# EAGLE design BBBCape (EAGLE 7.2.0)
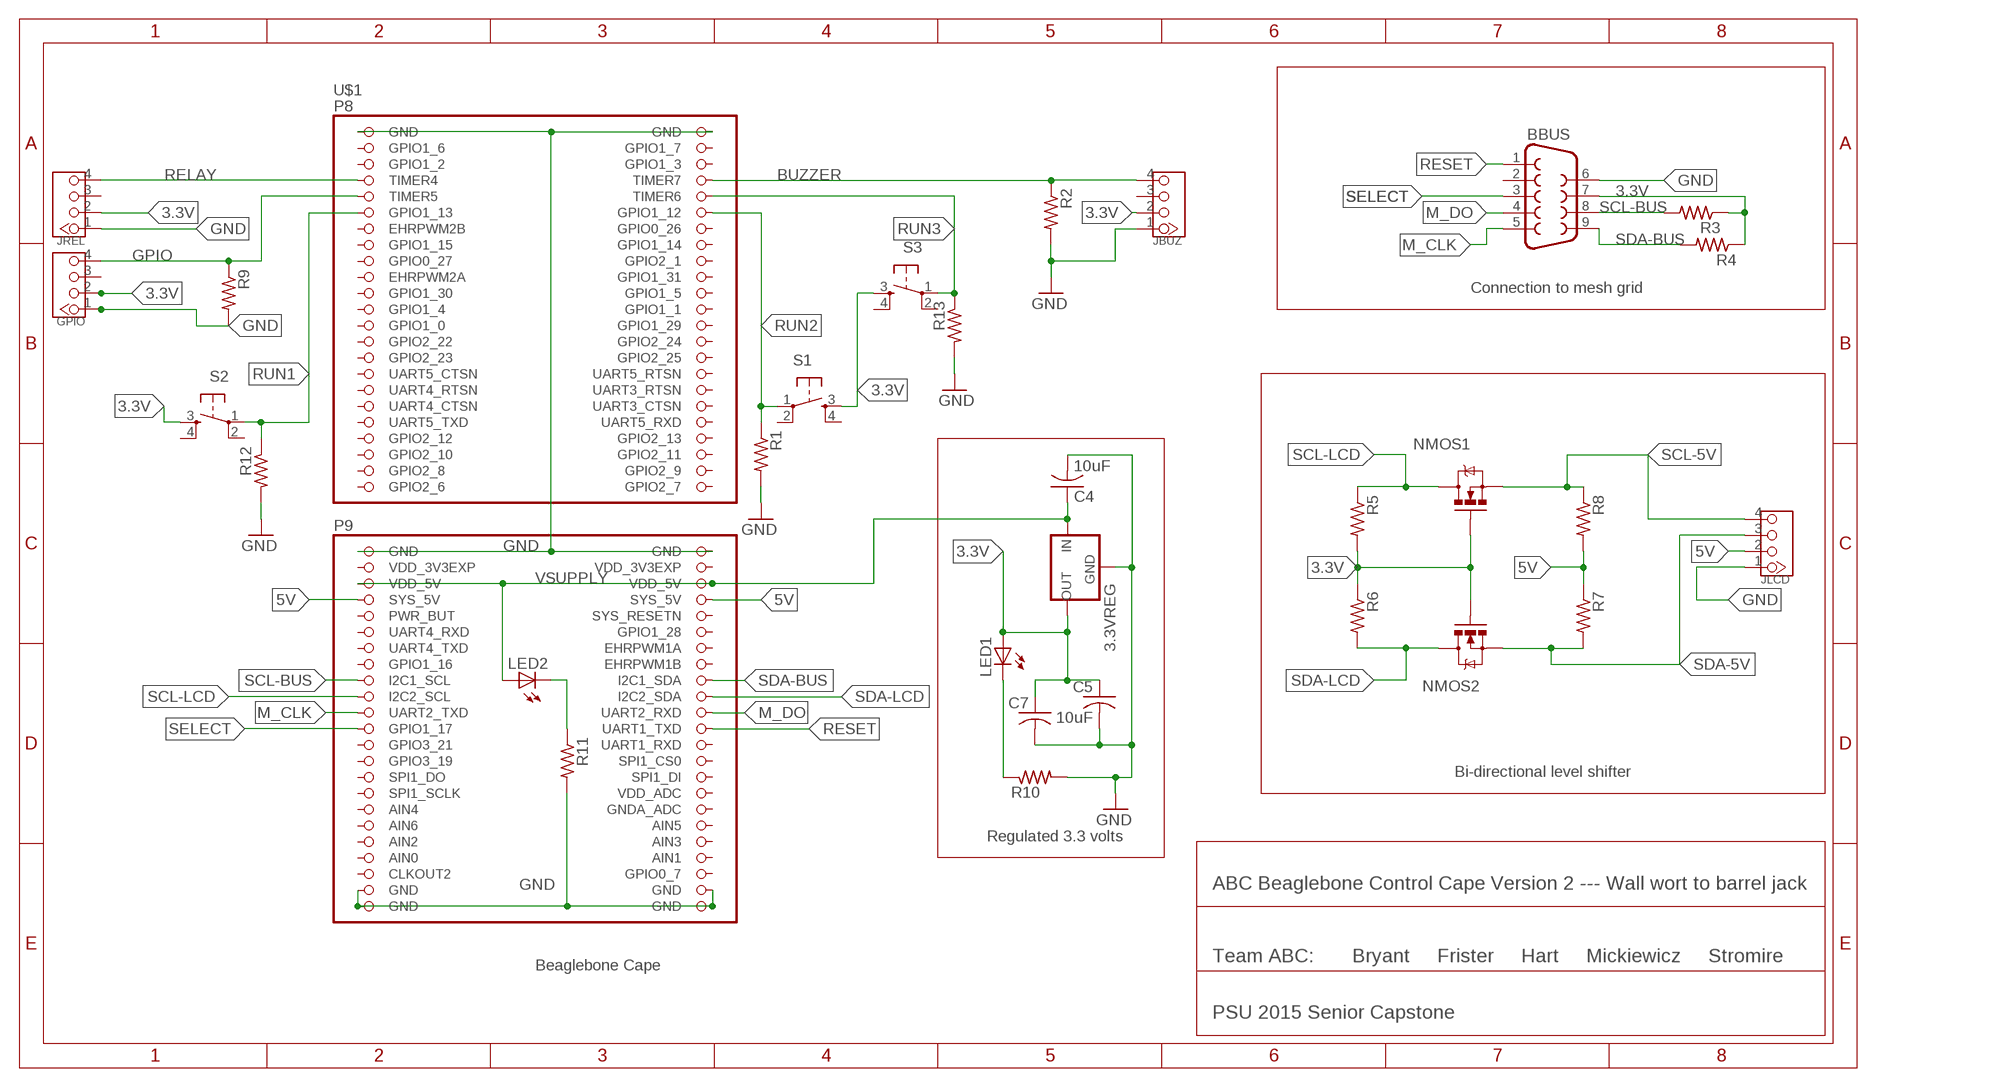
[diagram p0: schematic, sheet 1]

## Parts
3.3VREG  78XXS  [78XXS]
BBUS  F09H  [F09H]
C4  10uF  C-US025-024X044  [C025-024X044]
C5  10uF  C-US025-024X044  [C025-024X044]
C7  C-US025-024X044  [C025-024X044]
GPIO  TWIG-4P-2.0-2.0  [4P-2.0]
JBUZ  TWIG-4P-2.0-2.0  [4P-2.0]
JLCD  TWIG-4P-2.0-2.0  [4P-2.0]
JREL  TWIG-4P-2.0-2.0  [4P-2.0]
LED1  LED3MM  [LED3MM]
LED2  LED3MM  [LED3MM]
NMOS1  MOSFET-NCHANNEL2N7000  [TO-92]
NMOS2  MOSFET-NCHANNEL2N7000  [TO-92]
R1  R-US_0204/2V  [0204V]
R2  R-US_0204/2V  [0204V]
R3  R-US_0204/2V  [0204V]
R4  R-US_0204/2V  [0204V]
R5  R-US_0204/2V  [0204V]
R6  R-US_0204/2V  [0204V]
R7  R-US_0204/2V  [0204V]
R8  R-US_0204/2V  [0204V]
R9  R-US_0204/2V  [0204V]
R10  R-US_0204/2V  [0204V]
R11  R-US_0204/2V  [0204V]
R12  R-US_0204/2V  [0204V]
R13  R-US_0204/2V  [0204V]
S1  TAC_SWITCHPTH  [TACTILE-PTH]
S2  TAC_SWITCHPTH  [TACTILE-PTH]
S3  TAC_SWITCHPTH  [TACTILE-PTH]
U$1  BEAGLEBONE_OUTLINE  [BEAGLEBONE_SHIELD]

## Nets
3.3V: 3.3VREG.OUT BBUS.7 C5.1 C7.1 GPIO.2 JBUZ.2 JREL.2 LED1.A NMOS1.2(G) NMOS2.2(G) R3.1 R4.1 R5.2 R6.1 S1.3 S2.3 S3.3
5V: JLCD.2 R7.1 R8.2 U$1.53(SYS_5V) U$1.54(SYS_5V)
BUZZER: JBUZ.4 R2.1 U$1.8(TIMER7)
GND: 3.3VREG.GND BBUS.6 C4.2 C5.2 C7.2 GPIO.1 JBUZ.1 JLCD.1 JREL.1 R1.2 R2.2 R9.2 R10.2 R11.2 R12.2 R13.2 U$1.1(GND) U$1.2(GND) U$1.47(GND) U$1.48(GND) U$1.89(GND) U$1.90(GND) U$1.91(GND) U$1.92(GND)
GPIO: GPIO.4 R9.1 U$1.9(TIMER5)
M_CLK: BBUS.5 U$1.67(UART2_TXD)
M_DO: BBUS.4 U$1.68(UART2_RXD)
N$3: LED2.K(C) R11.1
N$4: LED1.K(C) R10.1
RELAY: JREL.4 U$1.7(TIMER4)
RESET: BBUS.1 U$1.70(UART1_TXD)
RUN1: R12.1 S2.1 U$1.11(GPIO1_13)
RUN2: R1.1 S1.1 U$1.12(GPIO1_12)
RUN3: R13.1 S3.1 U$1.10(TIMER6)
SCL-5V: JLCD.4 NMOS1.1(S) R8.1
SCL-BUS: BBUS.8 R3.2 U$1.63(I2C1_SCL)
SCL-LCD: NMOS1.3(D) R5.1 U$1.65(I2C2_SCL)
SDA-5V: JLCD.3 NMOS2.1(S) R7.2
SDA-BUS: BBUS.9 R4.2 U$1.64(I2C1_SDA)
SDA-LCD: NMOS2.3(D) R6.2 U$1.66(I2C2_SDA)
SELECT: BBUS.3 U$1.69(GPIO1_17)
VSUPPLY: 3.3VREG.IN C4.1 LED2.A U$1.51(VDD_5V) U$1.52(VDD_5V)
Unconnected: BBUS.2 GPIO.3 JBUZ.3 JREL.3 S1.2 S1.4 S2.2 S2.4 S3.2 S3.4 U$1.3(GPIO1_6) U$1.4(GPIO1_7) U$1.5(GPIO1_2) U$1.6(GPIO1_3) U$1.13(EHRPWM2B) U$1.14(GPIO0_26) U$1.15(GPIO1_15) U$1.16(GPIO1_14) U$1.17(GPIO0_27) U$1.18(GPIO2_1) U$1.19(EHRPWM2A) U$1.20(GPIO1_31) U$1.21(GPIO1_30) U$1.22(GPIO1_5) U$1.23(GPIO1_4) U$1.24(GPIO1_1) U$1.25(GPIO1_0) U$1.26(GPIO1_29) U$1.27(GPIO2_22) U$1.28(GPIO2_24) U$1.29(GPIO2_23) U$1.30(GPIO2_25) U$1.31(UART5_CTSN) U$1.32(UART5_RTSN) U$1.33(UART4_RTSN) U$1.34(UART3_RTSN) U$1.35(UART4_CTSN) U$1.36(UART3_CTSN) U$1.37(UART5_TXD) U$1.38(UART5_RXD) U$1.39(GPIO2_12) U$1.40(GPIO2_13) U$1.41(GPIO2_10) U$1.42(GPIO2_11) U$1.43(GPIO2_8) U$1.44(GPIO2_9) U$1.45(GPIO2_6) U$1.46(GPIO2_7) U$1.55(PWR_BUT) U$1.56(SYS_RESETN) U$1.57(UART4_RXD) U$1.58(GPIO1_28) U$1.59(UART4_TXD) U$1.60(EHRPWM1A) U$1.61(GPIO1_16) U$1.62(EHRPWM1B) U$1.71(GPIO3_21) U$1.72(UART1_RXD) U$1.73(GPIO3_19) U$1.74(SPI1_CS0) U$1.75(SPI1_DO) U$1.76(SPI1_DI) U$1.77(SPI1_SCLK) U$1.78(VDD_ADC) U$1.79(AIN4) U$1.80(GNDA_ADC) U$1.81(AIN6) U$1.82(AIN5) U$1.83(AIN2) U$1.84(AIN3) U$1.86(AIN1) U$1.87(CLKOUT2) U$1.88(GPIO0_7)

## Notes on the sheet
- Connection to mesh grid
- Bi-directional level shifter
- Regulated 3.3 volts
- ABC Beaglebone Control Cape | Version 2 --- Wall wort to barrel jack
- Team ABC:       Bryant     Frister     Hart     Mickiewicz     Stromire
- Beaglebone Cape
- PSU 2015 Senior Capstone

## Power pins joined to a net without a drawn wire
AIN0: U$1.85(AIN0)
VDD_3V3EXP: U$1.49(VDD_3V3EXP) U$1.50(VDD_3V3EXP)

## Library data of the parts
3.3VREG = v-reg:78XXS: VOLTAGE REGULATOR
BBUS = con-subd:F09: SUB-D; OC_FARNELL: unknown; OC_NEWARK: unknown
C4 C5 C7 = adafruit:C-US: CAPACITOR, American symbol
GPIO JBUZ JLCD JREL = Connector:TWIG-4P-2.0
LED1 LED2 = adafruit:LED: LED OSRAM: - CHIPLED LG R971, LG N971, LY N971, LG Q971, LY Q971, LO R971, LY R971 LH N974, LH R974 LS Q976, LO Q976, LY Q976 LO Q996 - Hyper CHIPLED LW Q18S LB Q993, LB Q99A, LB R99A - SideLED LS A670, LO A670, LY A670, LG A670, LP A670 LB A673, LV A673, LT A673, LW A673 LH A674 LY A675 LS A676, LA A676, LO A676, LY A676, LW A676 LS A679, LY A679, LG A679 - Hyper Micro SIDELED® LS Y876, LA Y876, LO Y876, LY Y876 LT Y87S - SmartLED LW L88C, LW L88S LB L89C, LB L89S, LG L890 LS L89K, LO L89K, LY L89K LS L896, LA L896, LO L896, LY L896 - TOPLED LS T670, LO T670, LY T670, LG T670, LP T670 LSG T670, LSP T670, LSY T670, LOP T670, LYG T670 LG T671, LOG T671, LSG T671 LB T673, LV T673, LT T673, LW T673 LH T674 LS T676, LA T676, LO T676, LY T676, LB T676, LH T676, LSB T676, LW T676 LB T67C, LV T67C, LT T67C, LS T67K, LO T67K, LY T67K, LW E67C LS E67B, LA E67B, LO E67B, LY E67B, LB E67C, LV E67C, LT E67C LW T67C LS T679, LY T679, LG T679 LS T770, LO T770, LY T770, LG T770, LP T770 LB T773, LV T773, LT T773, LW T773 LH T774 LS E675, LA E675, LY E675, LS T675 LS T776, LA T776, LO T776, LY T776, LB T776 LHGB T686 LT T68C, LB T68C - Hyper Mini TOPLED® LB M676 - Mini TOPLED Santana® LG M470 LS M47K, LO M47K, LY M47K Source: http://www.osram.convergy.de/
NMOS1 NMOS2 = SparkFun-DiscreteSemi:MOSFET-NCHANNEL: Common NMOSFET Parts MFG P/N Store ID Prod ID FDD8780 TRANS-09984 SI7820DN TRANS-11055 FDS6630A IC-08089 2N7002PW TRANS-11151 FQP30N06L COM-10213 TRANS-10060 BSS123LT1G TRANS-08345 BSS138 TRANS-00830 BS170 2N7000
R1-R13 = adafruit:R-US_: RESISTOR, American symbol
S1-S3 = SparkFun-Electromechanical:TAC_SWITCH: Momentary Switch Button commonly used for reset or general input. Spark Fun Electronics SKU : COM-00097 SMT- SWCH-08247
U$1 = adafruit:BEAGLEBONE_OUTLINE: Should match A3 pinout - but not completely tested

## Board
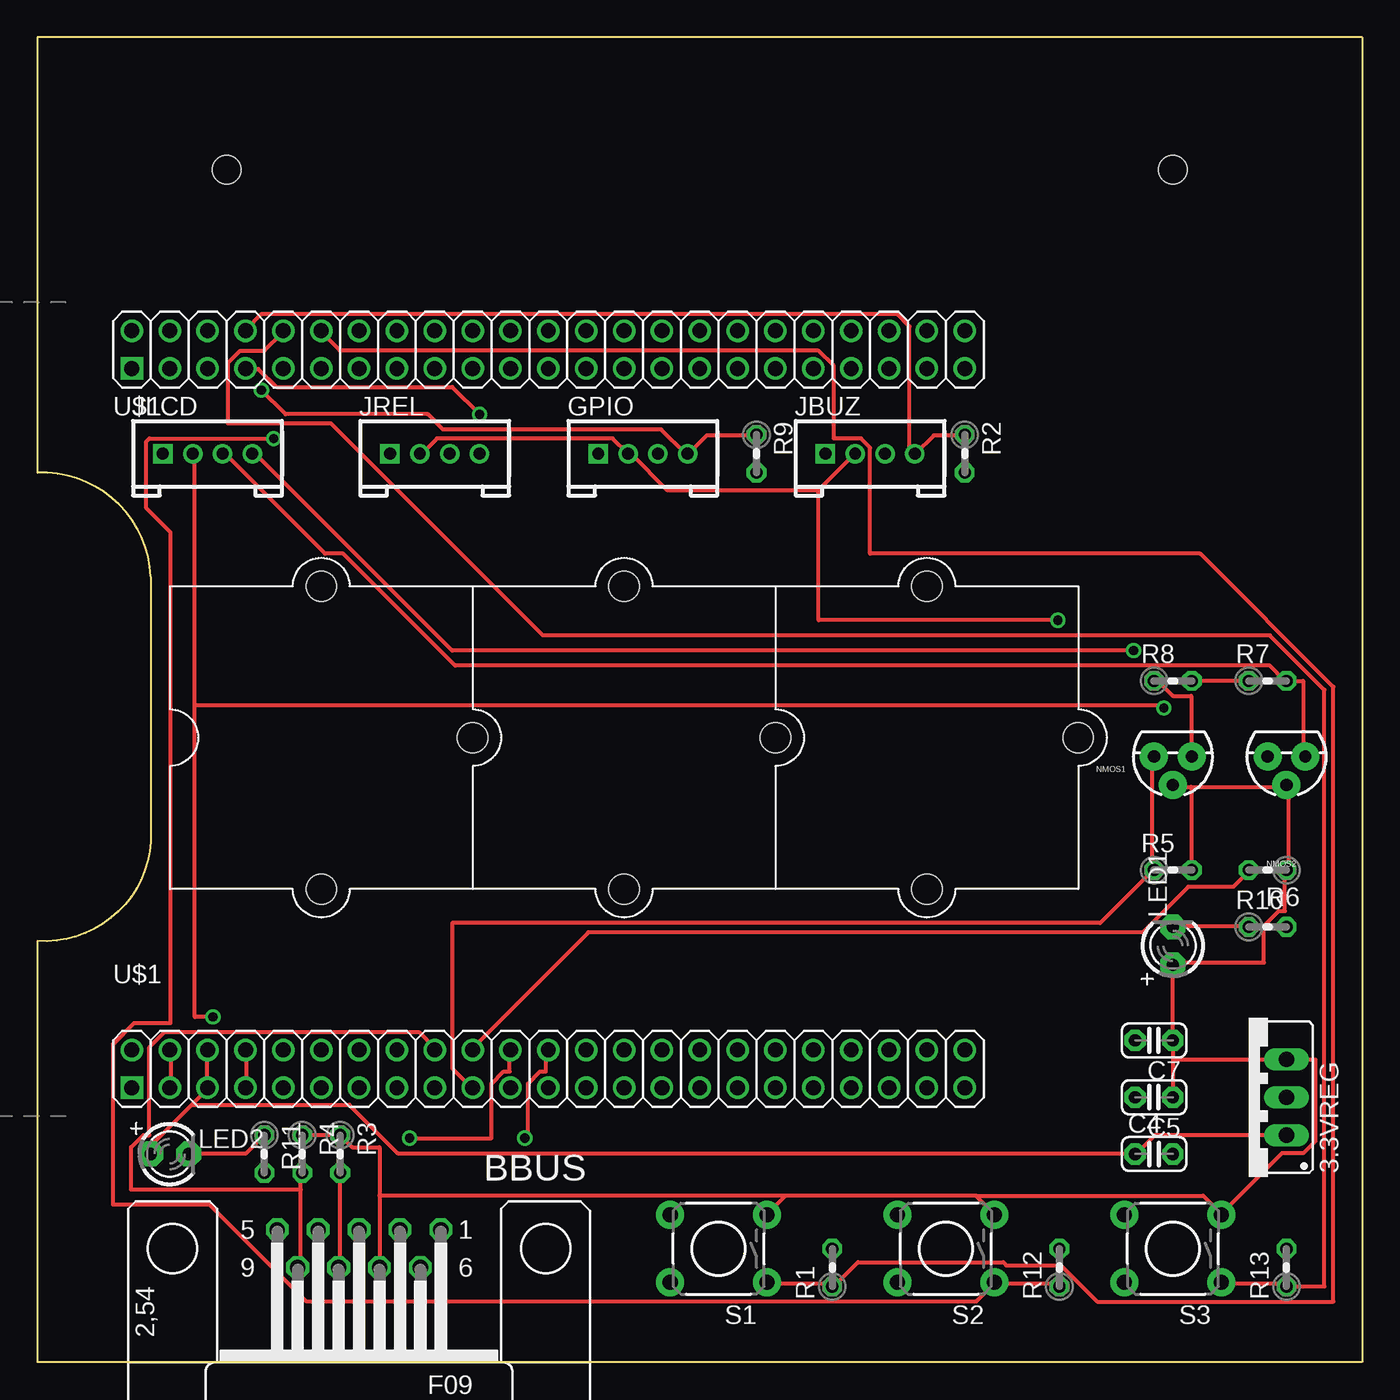
[diagram p1: board, top side]
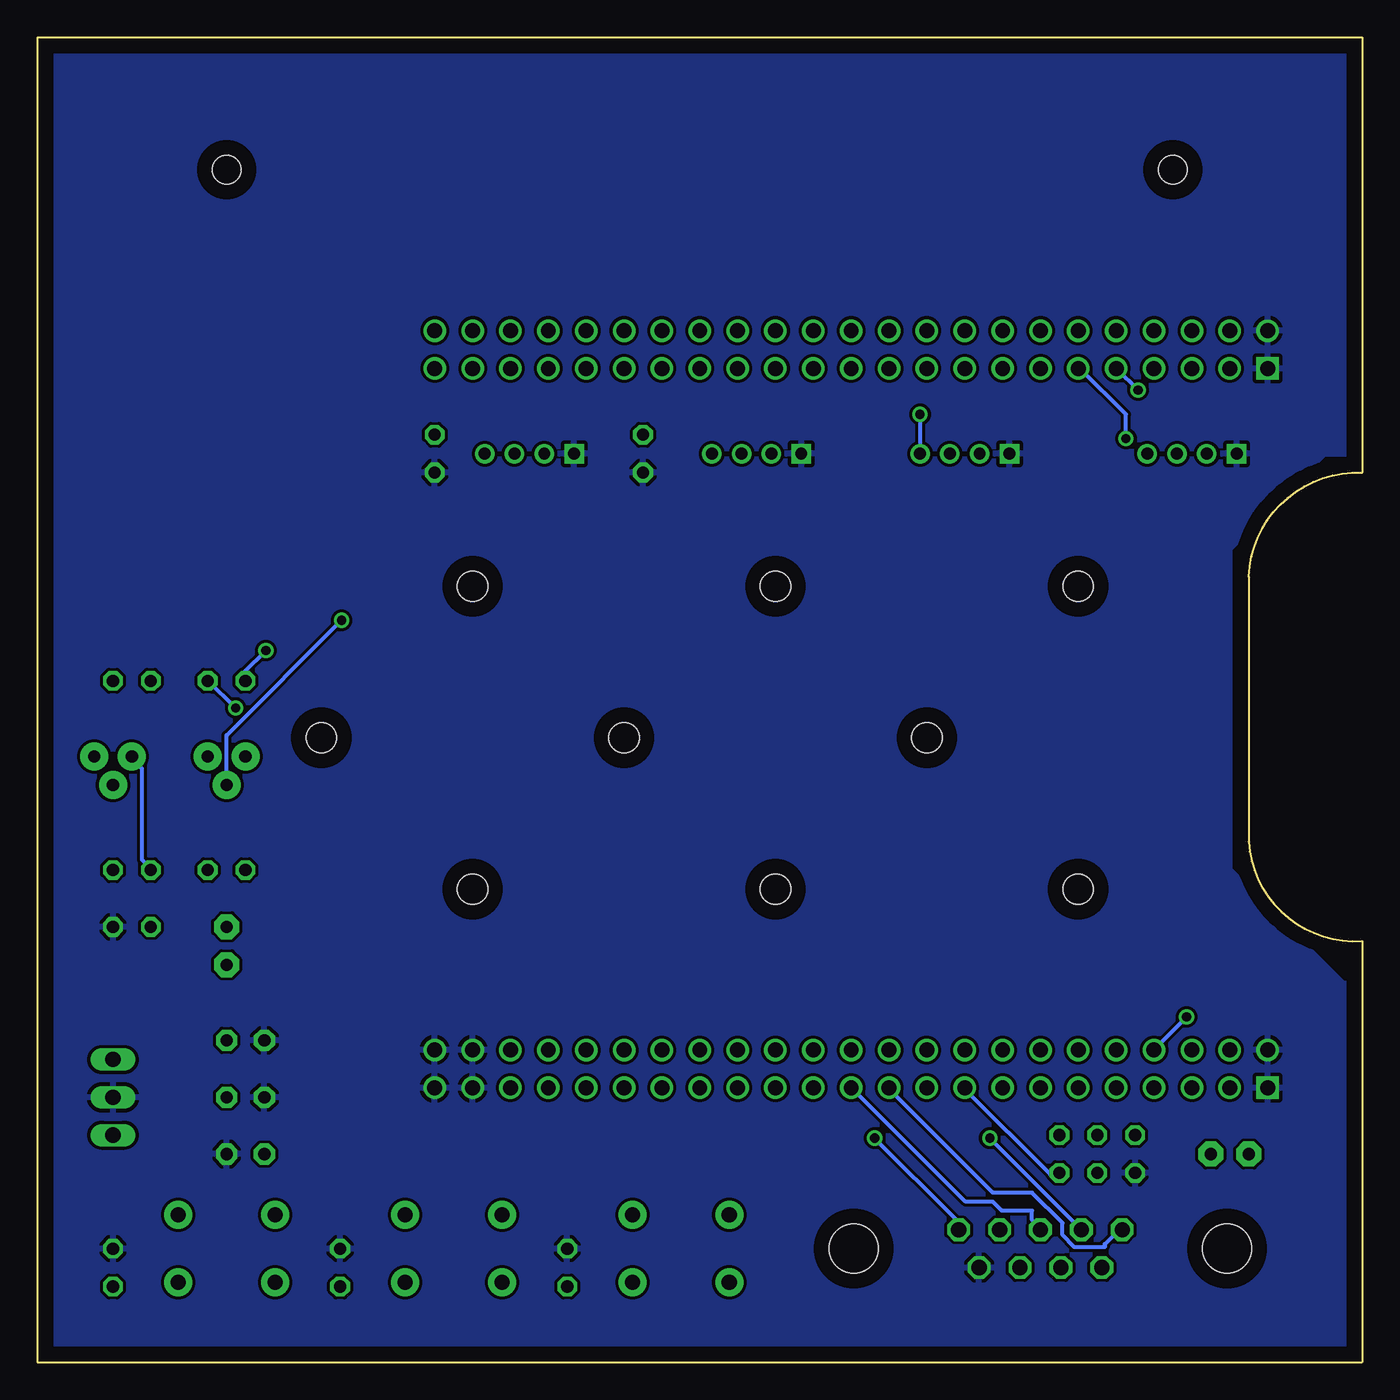
[diagram p2: board, bottom side, seen from below]

Size 88.9 x 88.9 mm. Coordinates in mm from the lower left corner, seen from the top.
Copper layers (1*16): Top 0.035mm / dielectric 1.5mm / Bottom 0.035mm
Design rules "default": minimum track width 10mil, minimum drill 24mil, track to track 8mil, track to pad 8mil, pad to pad 8mil, via to via 8mil, smd to smd 8mil, copper to edge 40mil, drill to drill 8mil, minimum pad ring 10mil, minimum via ring 8mil, stop-mask expansion 4mil, vias tented up to drill 0mil, thermal gap 10mil
Holes 1.92 mm at 12.7,80.01 76.2,80.01

### Footprints (pad centres in the part's own frame; a part is rotated, then mirrored left to right if it is on the bottom)
78XXS = drill 1.016 long: GND 0,-2.54; IN -2.54,-2.54; OUT 2.54,-2.54
F09H = drill 1.016 octagon: 1 -5.486,-1.27; 2 -2.743,-1.27; 3 0,-1.27; 4 2.743,-1.27; 5 5.486,-1.27; 6 -4.115,1.27; 7 -1.372,1.27; 8 1.372,1.27; 9 4.115,1.27 | hole 3.302: -12.522,0; 12.522,0
C025-024X044 = drill 0.813 pad 1.422 octagon: 1 -1.27,0; 2 1.27,0
SEEED = hole 2.019: 10.16,0; 10.16,20.32; 20.32,10.16
4P-2.0 = drill 0.8 pad 1.27 square: 1 -3,0 | drill 0.8 pad 1.27: 2 -1,0; 3 1,0; 4 3,0
LED3MM = drill 0.813 pad 1.676 octagon: A -1.27,0; K 1.27,0
TO-92 = drill 0.813 pad 1.88: 1 -1.27,0; 2 0,1.905; 3 1.27,0
0204V = drill 0.813 octagon: 1 -1.27,0; 2 1.27,0
TACTILE-PTH = drill 1.016 pad 1.88: 1 -3.251,2.261; 2 3.251,2.261; 3 -3.251,-2.261; 4 3.251,-2.261
BEAGLEBONE_SHIELD = drill 1 square: 1 6.35,66.675; 47 6.35,18.415 | drill 1: 2 6.35,69.215; 3 8.89,66.675; 4 8.89,69.215; 5 11.43,66.675; 6 11.43,69.215; 7 13.97,66.675; 8 13.97,69.215; 9 16.51,66.675; 10 16.51,69.215; 11 19.05,66.675; 12 19.05,69.215; 13 21.59,66.675; 14 21.59,69.215; 15 24.13,66.675; 16 24.13,69.215; 17 26.67,66.675; 18 26.67,69.215; 19 29.21,66.675; 20 29.21,69.215; 21 31.75,66.675; 22 31.75,69.215; 23 34.29,66.675; 24 34.29,69.215; 25 36.83,66.675; 26 36.83,69.215; 27 39.37,66.675; 28 39.37,69.215; 29 41.91,66.675; 30 41.91,69.215; 31 44.45,66.675; 32 44.45,69.215; 33 46.99,66.675; 34 46.99,69.215; 35 49.53,66.675; 36 49.53,69.215; 37 52.07,66.675; 38 52.07,69.215; 39 54.61,66.675; 40 54.61,69.215; 41 57.15,66.675; 42 57.15,69.215; 43 59.69,66.675; 44 59.69,69.215; 45 62.23,66.675; 46 62.23,69.215; 48 6.35,20.955; 49 8.89,18.415; 50 8.89,20.955; 51 11.43,18.415; 52 11.43,20.955; 53 13.97,18.415; 54 13.97,20.955; 55 16.51,18.415; 56 16.51,20.955; 57 19.05,18.415; 58 19.05,20.955; 59 21.59,18.415; 60 21.59,20.955; 61 24.13,18.415; 62 24.13,20.955; 63 26.67,18.415; 64 26.67,20.955; 65 29.21,18.415; 66 29.21,20.955; 67 31.75,18.415; 68 31.75,20.955; 69 34.29,18.415; 70 34.29,20.955; 71 36.83,18.415; 72 36.83,20.955; 73 39.37,18.415; 74 39.37,20.955; 75 41.91,18.415; 76 41.91,20.955; 77 44.45,18.415; 78 44.45,20.955; 79 46.99,18.415; 80 46.99,20.955; 81 49.53,18.415; 82 49.53,20.955; 83 52.07,18.415; 84 52.07,20.955; 85 54.61,18.415; 86 54.61,20.955; 87 57.15,18.415; 88 57.15,20.955; 89 59.69,18.415; 90 59.69,20.955; 91 62.23,18.415; 92 62.23,20.955

### Placement (x,y rotation side)
3.3VREG  81.28,17.78 90 top
BBUS  21.59,7.62 180 top
C4  74.93,13.97 0 top
C5  74.93,17.78 180 top
C7  74.93,21.59 180 top
E$1  [SEEED]  8.89,31.75 0 top
E$2  [SEEED]  29.21,31.75 0 top
E$3  [SEEED]  49.53,31.75 0 top
GPIO  40.64,60.96 0 top
JBUZ  55.88,60.96 0 top
JLCD  11.43,60.96 0 top
JREL  26.67,60.96 0 top
LED1  76.2,27.94 90 top
LED2  8.89,13.97 0 top
NMOS1  76.2,40.64 180 top
NMOS2  83.82,40.64 180 top
R1  53.34,6.35 90 top
R2  62.23,60.96 270 top
R3  20.32,13.97 270 top
R4  17.78,13.97 270 top
R5  76.2,33.02 0 top
R6  82.55,33.02 180 top
R7  82.55,45.72 0 top
R8  76.2,45.72 0 top
R9  48.26,60.96 270 top
R10  82.55,29.21 0 top
R11  15.24,13.97 270 top
R12  68.58,6.35 90 top
R13  83.82,6.35 90 top
S1  45.72,7.62 180 top
S2  60.96,7.62 180 top
S3  76.2,7.62 180 top
U$1  0,0 0 top

### Tracks (layer width: path | path; a pad name or v marks a point on that pad's centre or on a via)
3.3V  (via drill 0.61)
  Top 0.254: R4.1 R3.1 21.13,14.43 22.96,14.43 22.96,11.18 | 22.96,11.18 BBUS.7 | 50.19,11.18 48.97,9.96 S1.3 | 62.99,11.18 50.19,11.18 | 62.99,11.18 64.21,9.96 S2.3 | 79.45,9.96 78.23,11.18 62.99,11.18 | 50.19,11.18 22.96,11.18 | JREL.2 25.81,60.96 26.82,61.98 38.61,61.98 39.62,60.96 GPIO.2 39.83,60.96 42.27,58.52 52.43,58.52 | 52.43,58.52 54.86,60.96 JBUZ.2 | 77.42,38.61 77.42,33.12 R5.2 | 77.42,38.61 76.2,38.61 NMOS1.2 | 77.42,38.61 83.72,38.61 NMOS2.2 83.92,38.61 83.92,33.12 R6.1 83.72,32.92 83.72,30.28 83.31,30.28 82.3,29.26 82.3,26.82 76.2,26.82 LED1.A C7.1 76.2,20.32 | 76.2,20.32 C5.1 | 76.2,20.32 3.3VREG.OUT 85.75,20.32 85.75,14.83 84.94,14.02 83.52,14.02 79.45,9.96 | 52.43,58.52 52.43,49.78 v68.48,49.78 | 79.45,9.96 S3.3
  Bottom 0.254: v68.48,49.78 76.2,42.06 NMOS1.2
5V  (via drill 0.61)
  Top 0.254: R7.1 R8.2 | 10.57,44.09 10.57,23.16 v11.79,23.16 | 10.57,44.09 10.57,60.96 JLCD.2 | U$1.53 14.02,18.49 14.02,20.93 U$1.54 | v75.59,43.89 75.39,44.09 10.57,44.09
  Bottom 0.254: v11.79,23.16 13.82,21.13 U$1.54 | v75.59,43.89 77.42,45.72 R8.2
BUZZER
  Top 0.254: R2.1 62.18,62.18 60.15,62.18 58.93,60.96 JBUZ.4 58.52,60.96 58.52,69.49 57.71,70.31 15.04,70.31 14.02,69.29 U$1.8
GND
  pour Bottom: 0,88.9 88.9,88.9 88.9,80.01 88.9,0 0,0 0,25.4 1.27,25.4 8.89,33.02 8.89,54.61 7.62,55.88 2.54,60.96 0,60.96
GPIO  (via drill 0.61)
  Top 0.254: R9.1 48.16,62.18 44.91,62.18 43.69,60.96 GPIO.4 43.48,60.96 41.86,62.59 27.23,62.59 26.21,63.6 16.66,63.6 v15.04,65.23
  Bottom 0.254: v15.04,65.23 16.46,66.65 U$1.9
M_CLK
  Bottom 0.254: U$1.67 31.7,18.29 24.79,11.38 22.15,11.38 20.12,9.35 20.12,8.53 19.3,7.72 17.27,7.72 17.27,7.92 16.26,8.94 BBUS.5
M_DO  (via drill 0.61)
  Top 0.254: v24.99,15.04 30.48,15.04 30.48,18.69 31.29,19.51 31.7,19.51 31.7,20.93 U$1.68
  Bottom 0.254: BBUS.4 v24.99,15.04
N$3
  Top 0.254: R11.1 14.02,14.02 10.16,14.02 LED2.K
N$4
  Top 0.254: R10.1 81.28,29.26 76.2,29.26 LED1.K
RELAY  (via drill 0.61)
  Top 0.254: v29.67,63.6 27.84,65.43 16.05,65.43 14.83,66.65 14.02,66.65 U$1.7
  Bottom 0.254: v29.67,63.6 JREL.4
RESET  (via drill 0.61)
  Top 0.254: v32.72,15.04 32.92,15.04 32.92,18.69 33.73,19.51 34.14,19.51 34.14,20.93 U$1.70
  Bottom 0.254: v32.72,15.04 27.23,9.55 27.23,8.94 BBUS.1
RUN1  (via drill 0.61)
  Top 0.254: 64.21,5.28 68.28,5.28 68.48,5.08 R12.1 | v15.85,61.98 7.52,61.98 7.32,61.77 7.32,57.3 8.94,55.68 8.94,22.76 6.5,22.76 5.08,21.34 5.08,10.57 11.58,10.57 18.09,4.06 62.99,4.06 64.21,5.28 | 64.21,5.28 S2.1
  Bottom 0.254: v15.85,61.98 15.85,63.6 18.9,66.65 U$1.11
RUN2
  Top 0.254: S1.1 48.97,5.28 53.03,5.28 53.24,5.08 R1.1 53.44,5.08 55.07,6.71 64.82,6.71 65.02,6.5 68.68,6.5 71.12,4.06 86.97,4.06 86.97,45.31 78.03,54.25 55.88,54.25 55.88,61.37 55.27,61.98 53.44,61.98 53.44,66.85 52.43,67.87 20.32,67.87 19.1,69.09 U$1.12
RUN3
  Top 0.254: S3.1 79.45,5.28 83.52,5.28 83.72,5.08 R13.1 86.36,5.08 86.36,45.11 82.7,48.77 33.93,48.77 19.71,62.99 12.8,62.99 12.8,67.06 13.61,67.87 15.24,67.87 16.46,69.09 U$1.10
SCL-5V  (via drill 0.61)
  Top 0.254: v73.56,47.75 27.84,47.75 14.63,60.96 JLCD.4 | R8.1 75.18,45.72 76.2,44.7 77.42,44.7 77.42,40.64 NMOS1.1
  Bottom 0.254: v73.56,47.75 74.98,46.33 74.98,45.72 R8.1
SCL-BUS
  Top 0.254: R3.2 20.32,6.5 BBUS.8
  Bottom 0.254: U$1.63 26.62,18.29 20.93,12.6 20.32,12.6 R3.2
SCL-LCD
  Top 0.254: NMOS1.3 74.78,40.64 74.78,33.12 R5.1 74.78,32.92 71.32,29.46 27.84,29.46 27.84,19.71 29.06,18.49 U$1.65
SDA-5V
  Top 0.254: JLCD.3 12.6,60.96 19.3,54.25 20.52,54.25 28.04,46.74 82.7,46.74 83.72,45.72 R7.2 84.94,45.72 84.94,40.64 NMOS2.1
SDA-BUS
  Top 0.254: 17.68,11.58 17.68,6.5 17.48,6.5 BBUS.9 | 17.68,11.58 17.68,12.6 R4.2 | 17.68,11.58 6.3,11.58 6.3,14.43 7.11,15.24 7.52,15.24 7.52,21.13 8.53,22.15 25.6,22.15 26.62,21.13 U$1.64
SDA-LCD
  Top 0.254: U$1.66 29.26,21.13 36.98,28.85 74.17,28.85 77.22,31.9 80.26,31.9 81.28,32.92 R6.2
  Bottom 0.254: R6.2 81.28,33.12 81.89,33.73 81.89,39.83 82.5,40.44 82.5,40.64 NMOS2.3
SELECT
  Bottom 0.254: U$1.69 34.14,18.29 26.62,10.77 24.79,10.77 24.18,10.16 22.15,10.16 22.15,9.55 21.74,9.14 21.74,8.94 BBUS.3
VDD_3V3EXP
  Top 0.254: U$1.49 8.94,18.49 8.94,20.93 U$1.50
VSUPPLY
  Top 0.254: 3.3VREG.IN 74.98,15.24 73.76,14.02 C4.1 73.56,14.02 24.18,14.02 20.93,17.27 10.36,17.27 | U$1.52 11.38,20.93 11.38,18.49 U$1.51 11.38,18.29 10.36,17.27 | 10.36,17.27 7.72,14.63 7.72,14.02 LED2.A